# Altium schematic sheet Cover_sheet.SchDoc: Cover Sheet
size A4; Date: 32.3.2016; DrawnBy: fill this; Engineer: Matjaž Tome; DocumentNumber: 8; Revision: B; SheetNumber: 10; SheetTotal: 10; Project: USB DAQ
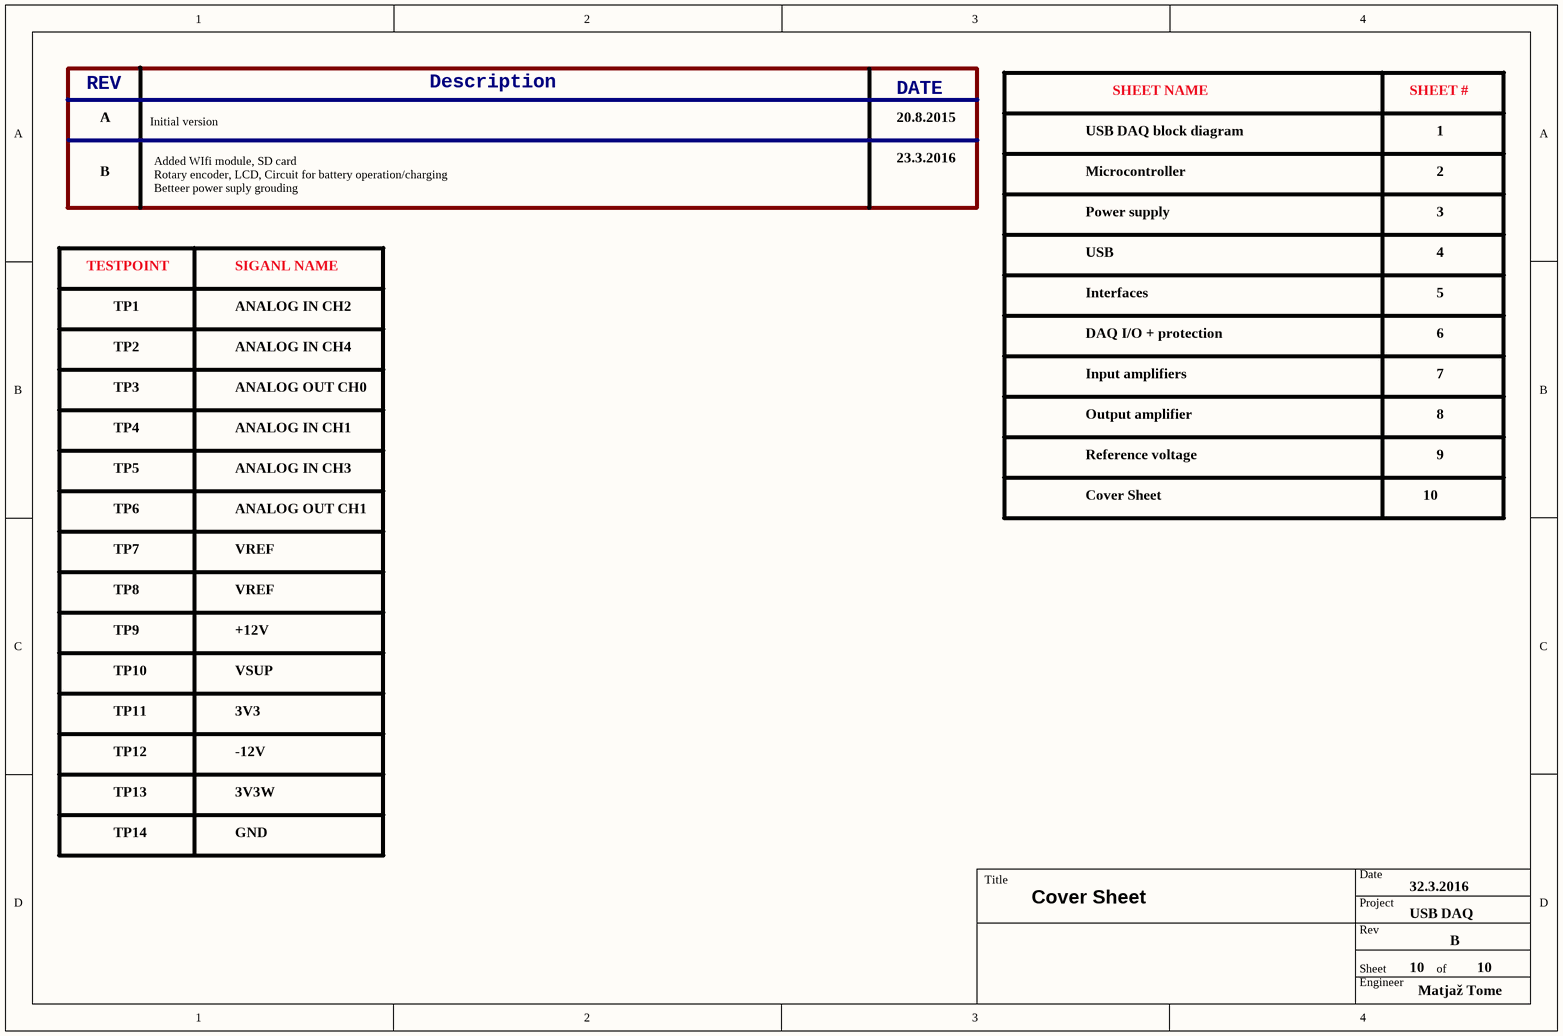
[diagram p0: Cover_sheet.SchDoc]

## Notes on the sheet
- REV
- Description
- DATE
- SHEET NAME
- SHEET #
- A
- B
- Initial version
- 20.8.2015
- 23.3.2016
- USB DAQ block diagram
- Microcontroller
- 1
- 2
- Added WIfi module, SD card
  Rotary encoder, LCD, Circuit for battery operation/charging
  Betteer power suply grouding
- Power supply
- 3
- TESTPOINT
- TP1
- SIGANL NAME
- ANALOG IN CH2
- Interfaces
- USB
- 4
- 5
- TP2
- ANALOG IN CH4
- Input amplifiers
- DAQ I/O + protection
- 6
- 7
- TP3
- TP4
- ANALOG IN CH1
- ANALOG OUT CH0
- Output amplifier
- 8
- TP5
- TP6
- ANALOG IN CH3
- ANALOG OUT CH1
- Cover Sheet
- Reference voltage
- 10
- 9
- TP7
- VREF
- TP8
- TP9
- +12V
- TP10
- TP11
- VSUP
- 3V3
- TP12
- -12V
- TP13
- TP14
- 3V3W
- GND
- Title
- Date
- Project
- Rev
- Engineer
- Sheet
- of